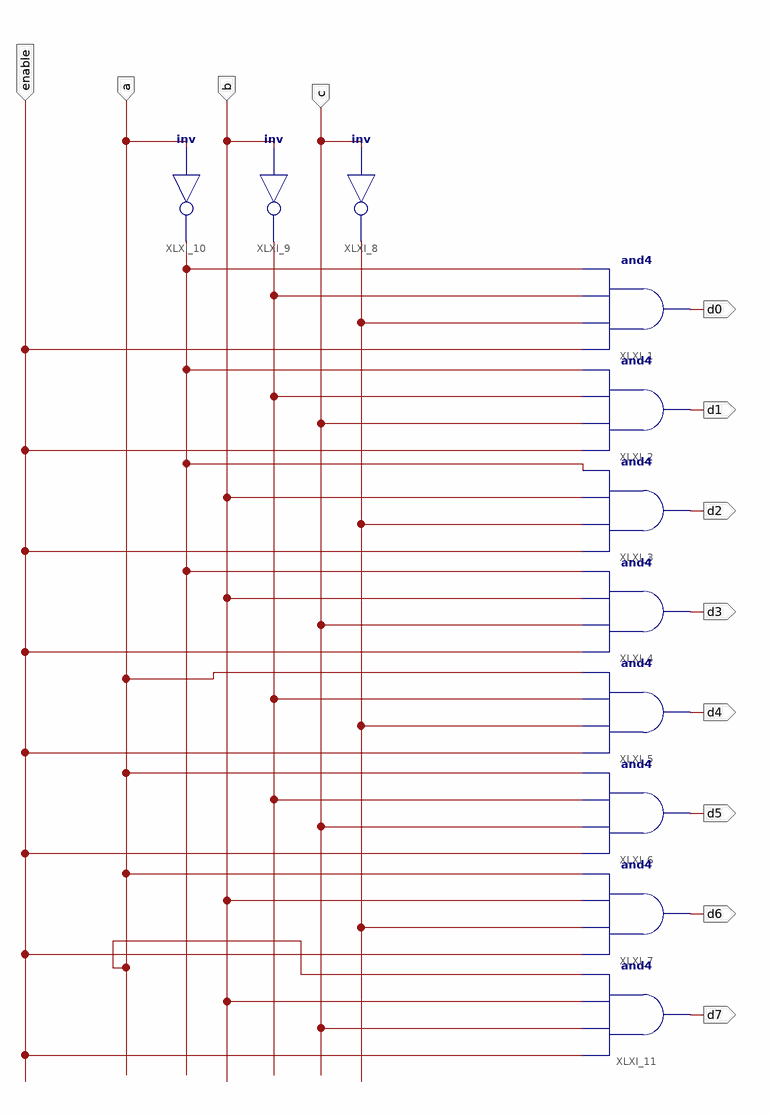
[diagram p0: schematic sheet 1]
// Xilinx ISE schematic sprinkler_circuit.sch (artix7) as structural Verilog: 11 symbols, 12 ports
module sprinkler_circuit (
  input  c,
  input  b,
  input  a,
  input  enable,
  output d0,
  output d1,
  output d2,
  output d3,
  output d4,
  output d5,
  output d6,
  output d7
);

  wire XLXN_3, XLXN_4, XLXN_10;

  and XLXI_1 (d0, enable, XLXN_4, XLXN_3, XLXN_10);
  and XLXI_2 (d1, enable, c, XLXN_3, XLXN_10);
  and XLXI_3 (d2, enable, XLXN_4, b, XLXN_10);
  and XLXI_4 (d3, enable, c, b, XLXN_10);
  and XLXI_5 (d4, enable, XLXN_4, XLXN_3, a);
  and XLXI_6 (d5, enable, c, XLXN_3, a);
  and XLXI_7 (d6, enable, XLXN_4, b, a);
  not XLXI_8 (XLXN_4, c);
  not XLXI_9 (XLXN_3, b);
  not XLXI_10 (XLXN_10, a);
  and XLXI_11 (d7, enable, c, b, a);
endmodule
